# EAGLE design sensors (EAGLE 7.7.0)
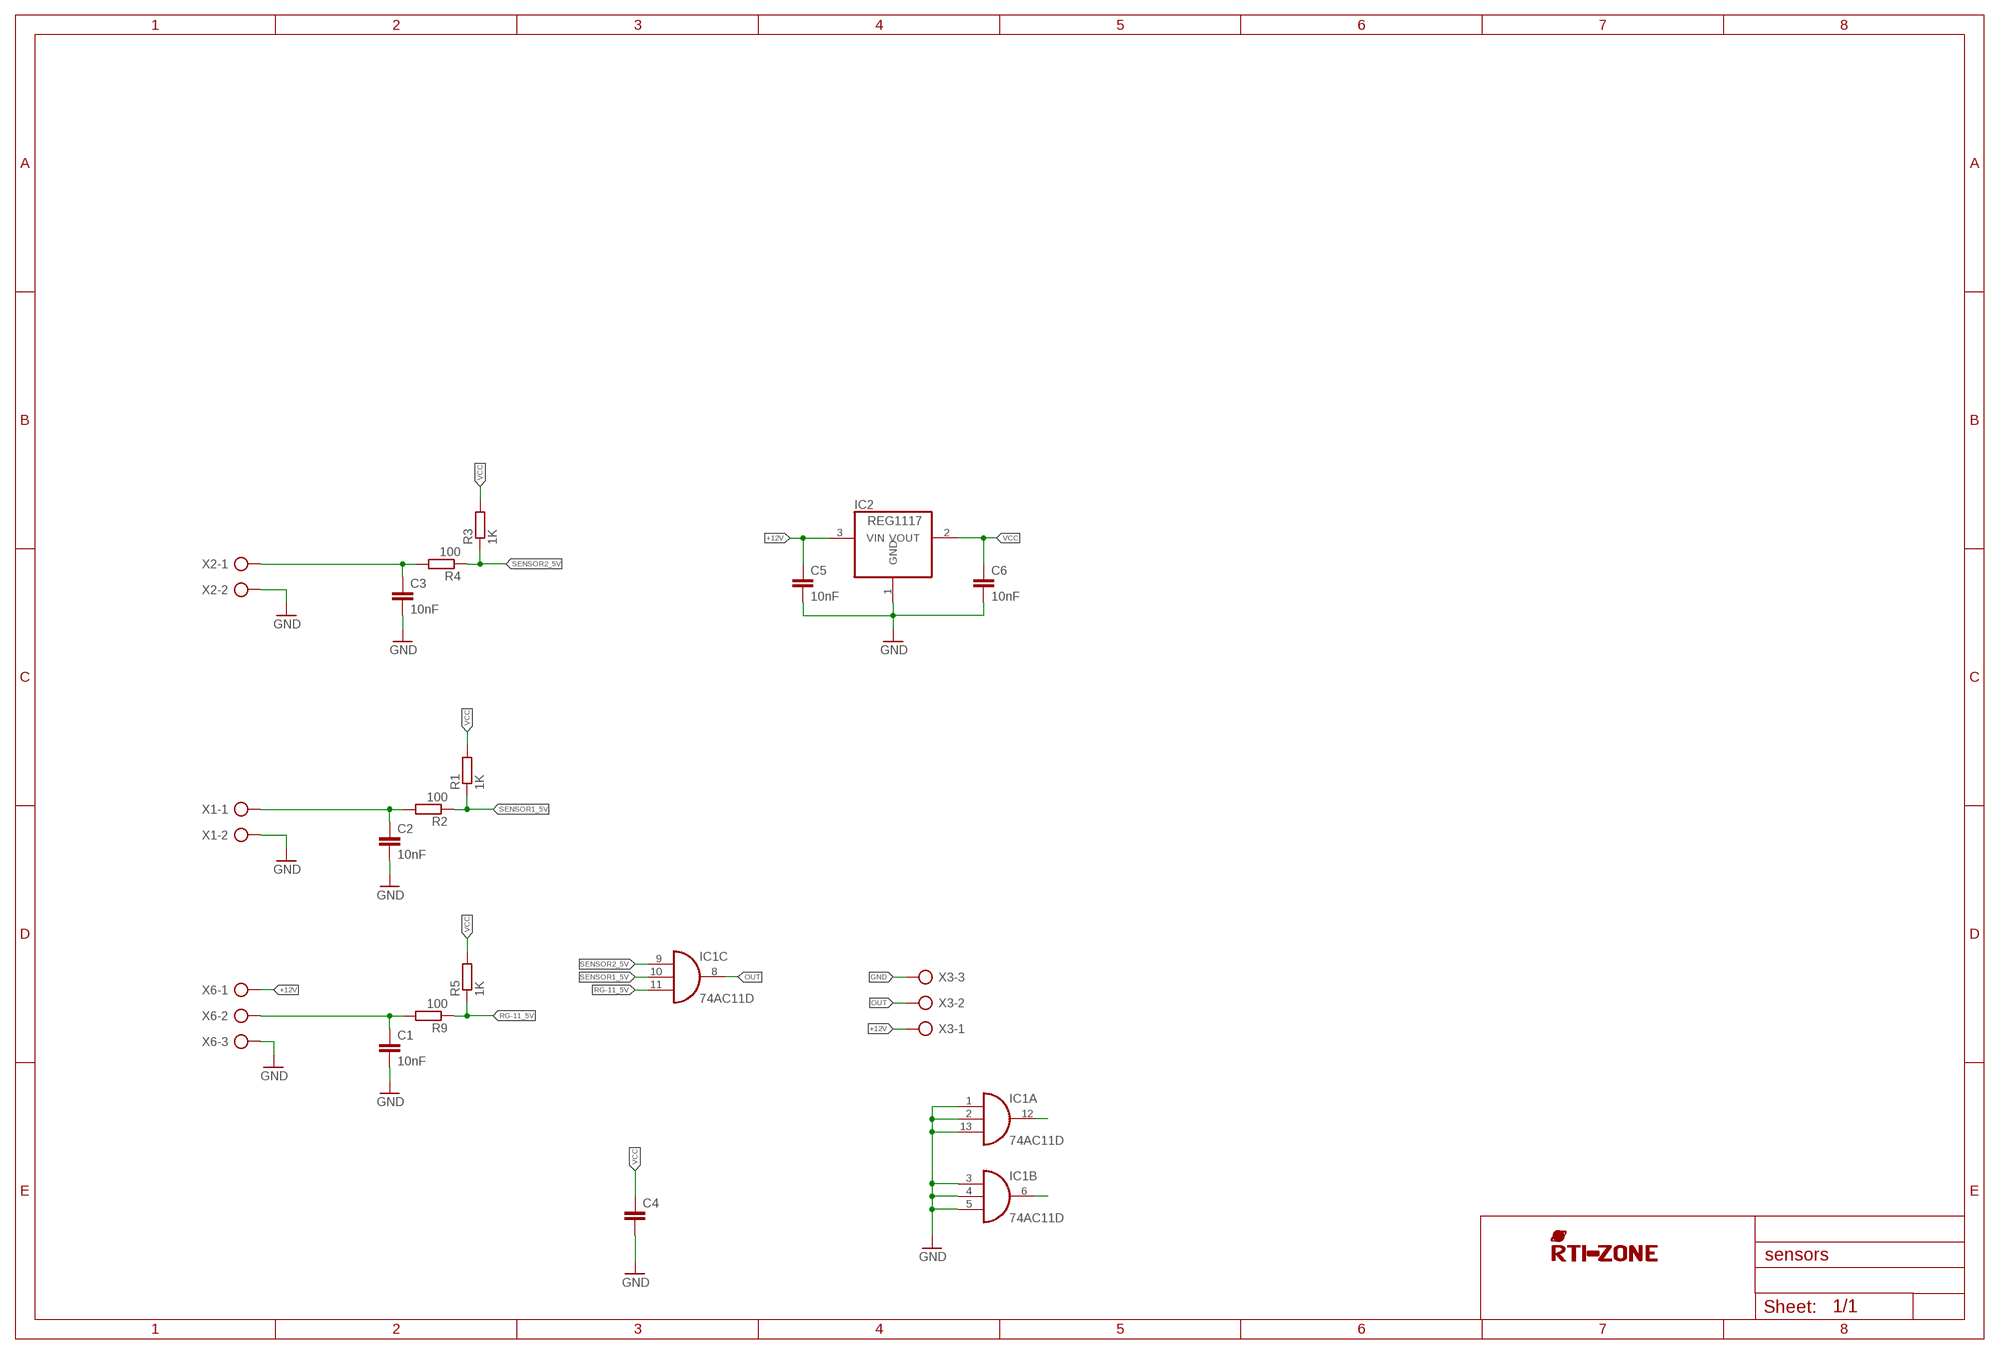
[diagram p0: schematic, sheet 1]

## Parts
C1  10nF  C-EU'0805'  [C0805]
C2  10nF  C-EU'0805'  [C0805]
C3  10nF  C-EU'0805'  [C0805]
C4  C-EU'1206'  [C1206]
C5  10nF  C-EU'0805'  [C0805]
C6  10nF  C-EU'0805'  [C0805]
IC1  74AC11D  [SO14]
IC2  REG1117  [SOT223]
R1  1K  R-EU'0805'  [R0805]
R2  100  R-EU'0805'  [R0805]
R3  1K  R-EU'0805'  [R0805]
R4  100  R-EU'0805'  [R0805]
R5  1K  R-EU'0805'  [R0805]
R9  100  R-EU'0805'  [R0805]
U$1  RTI-LOGO_BIG  [LOGO_BIG]
X1  AK500/2  [AK500/2]
X2  AK500/2  [AK500/2]
X3  AK500/3  [AK500/3]
X6  AK500/3  [AK500/3]

## Nets
+12V [+12V]: C5.1 IC2.3(VIN) X3.1 X6.1
GND: C1.2 C2.2 C3.2 C4.2 C5.2 C6.2 IC1.1(A:I0) IC1.2(A:I1) IC1.3(B:I0) IC1.4(B:I1) IC1.5(B:I2) IC1.13(A:I2) IC2.1(GND) X1.2 X2.2 X3.3 X6.3
N$1: IC1.12(A:O)
N$2: IC1.6(B:O)
OUT: IC1.8(C:O) X3.2
RG-11: C1.1 R9.2 X6.2
RG-11_5V: IC1.11(C:I2) R5.1 R9.1
SENSOR1: C2.1 R2.2 X1.1
SENSOR1_5V: IC1.10(C:I1) R1.1 R2.1
SENSOR2: C3.1 R4.2 X2.1
SENSOR2_5V: IC1.9(C:I0) R3.1 R4.1
VCC: C4.1 C6.1 IC2.2(VOUT) R1.2 R3.2 R5.2

## Power pins joined to a net without a drawn wire
GND: IC1.7(P:GND)
VCC: IC1.14(P:VCC)

## Library data of the parts
C1-C6 = rti:C-EU
IC1 = 74xx-eu:74*11: Triple 3-input AND gate
IC2 = burr-brown:REG1117: 800mA and 1A Low Dropout (LDO) Positive Regulator 1.8V, 2.5V, 2.85V, 3.3V, 5V, and Adj; MPN: REG1117; OC_FARNELL: 1097566; OC_NEWARK: 14P6981
R1-R5 R9 = rti:R-EU
U$1 = rti:RTI-LOGO
X1 X2 = nexdome:AK500/2: CONNECTOR; MF: Altech; MPN: Altech 30.702
X3 X6 = nexdome:AK500/3: CONNECTOR; MF: Altech; MPN: Altech 30.703

## Net classes
0 default: width 0.254 mm, drill 0.3 mm, clearance 0.203 mm
1 +12V: width 0.406 mm, drill 0.3 mm, clearance 0.203 mm

## Board
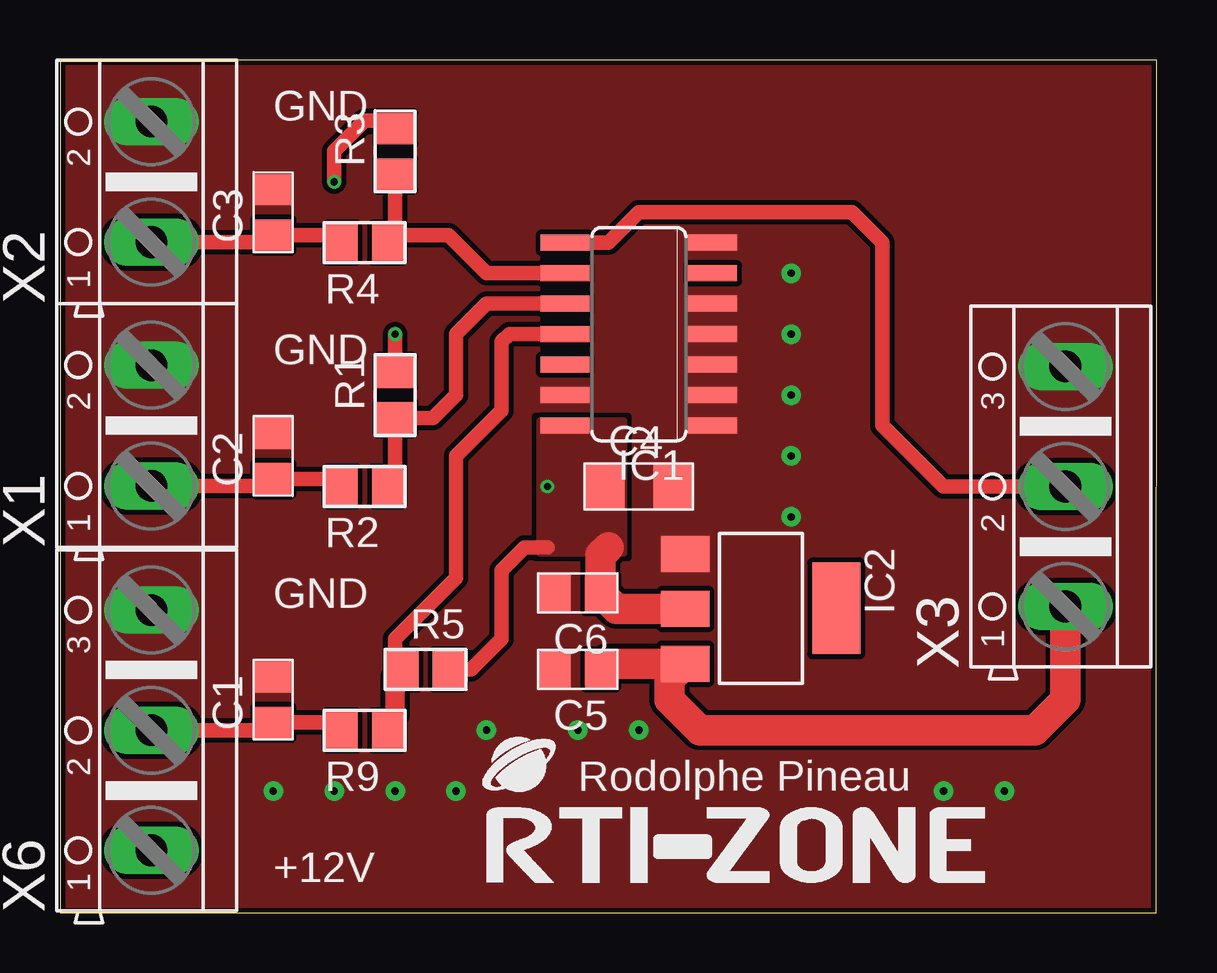
[diagram p1: board, top side]
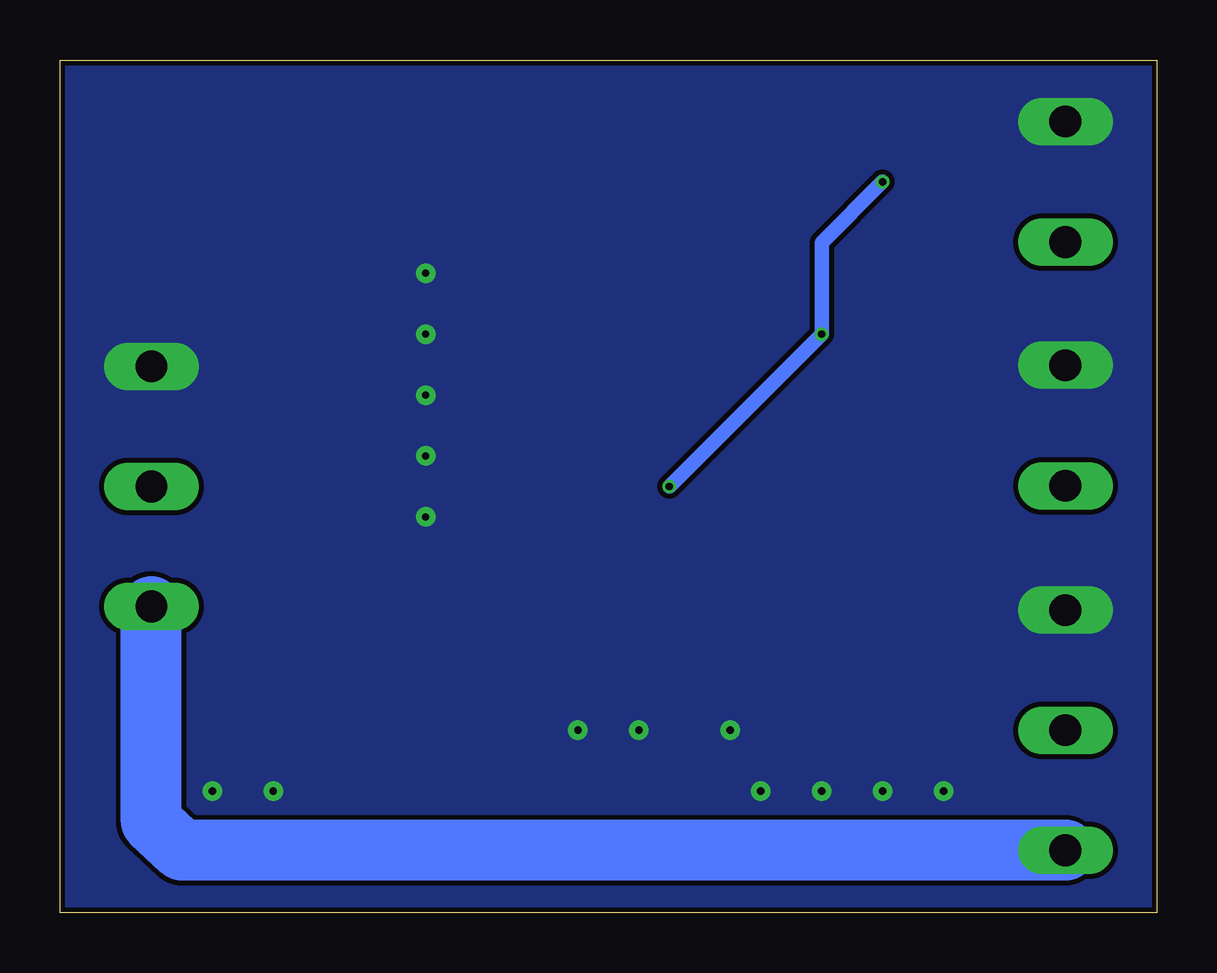
[diagram p2: board, bottom side, seen from below]

Size 45.72 x 35.56 mm. Coordinates in mm from the lower left corner, seen from the top.
Outline: 0,0 45.7,0 45.72,35.56 0,35.56 0,0
Copper layers (1*16): Top 0.035mm / dielectric 1.6mm / Bottom 0.035mm
Design rules "jlcpcb2layer": minimum track width 5mil, minimum drill 0.2mm, track to track 5mil, track to pad 5mil, pad to pad 5mil, via to via 5mil, smd to smd 5mil, copper to edge 8mil, drill to drill 0.5mm, minimum pad ring 0.13mm, minimum via ring 0.13mm, stop-mask expansion 0.05mm, vias tented up to drill 40mil, thermal gap 10mil

### Footprints (pad centres in the part's own frame; a part is rotated, then mirrored left to right if it is on the bottom)
C0805 = smd 1.3 x 1.5: 1 -0.95,0; 2 0.95,0
C1206 = smd 1.6 x 1.8: 1 -1.4,0; 2 1.4,0
SO14 = smd 0.66 x 2.032: 1 -3.81,-3.073; 2 -2.54,-3.073; 3 -1.27,-3.073; 4 0,-3.073; 5 1.27,-3.073; 6 2.54,-3.073; 7 3.81,-3.073; 8 3.81,3.073; 9 2.54,3.073; 10 1.27,3.073; 11 0,3.073; 12 -1.27,3.073; 13 -2.54,3.073; 14 -3.81,3.073
SOT223 = smd 1.499 x 2.007: 1 -2.261,-3.15; 2 0.025,-3.15; 3 2.311,-3.15 | smd 3.81 x 2.007: 4 0,3.15
R0805 = smd 1.3 x 1.5: 1 -0.95,0; 2 0.95,0
AK500/2 = drill 1.321 long: 1 -2.515,0; 2 2.515,0
AK500/3 = drill 1.321 long: 1 -5.004,0; 2 0,0; 3 5.004,0

### Placement (x,y rotation side)
C1  8.89,8.89 90 top
C2  8.89,19.05 90 top
C3  8.89,29.21 90 top
C4  24.13,17.78 0 top
C5  21.59,10.16 180 top
C6  21.59,13.34 180 top
IC1  24.13,24.13 90 top
IC2  29.21,12.7 270 top
R1  13.97,21.59 90 top
R2  12.7,17.78 180 top
R3  13.97,31.75 90 top
R4  12.7,27.94 180 top
R5  15.24,10.16 0 top
R9  12.7,7.62 180 top
U$1  17.78,1.27 0 top
X1  3.81,20.32 90 top
X2  3.81,30.48 90 top
X3  41.91,17.78 90 top
X6  3.81,7.62 90 top

### Tracks (layer width: path | path; a pad name or v marks a point on that pad's centre or on a via)
+12V
  Top 1.27: X3.1 41.91,8.89 40.64,7.62 26.67,7.62 25.4,8.89 25.4,9.73 IC2.3 22.77,10.39 C5.1
  Bottom 2.54: X6.1 40.64,2.62 41.91,3.81 X3.1
GND  (via drill 0.3 pad 0.81)
  other vias: 30.48,26.67 30.48,24.13 30.48,21.59 30.48,19.05 30.48,16.51 8.89,5.08 11.43,5.08 13.97,5.08 16.51,5.08 17.78,7.62 21.59,7.62 24.13,7.62 36.83,5.08 39.37,5.08
  pour Bottom (no thermals): 0,0 0,35.56 45.72,35.56 45.72,0
  pour Top (rank 2, no thermals): 0,0 0,35.56 45.72,35.56 45.72,0
OUT
  Top 0.61: IC1.8 22.86,27.94 24.13,29.21 33.02,29.21 34.29,27.94 34.29,20.32 36.83,17.78 X3.2
RG-11
  Top 0.61: X6.2 8.57,7.62 C1.1 11.43,7.94 R9.2
RG-11_5V
  Top 0.61: R9.1 13.97,7.94 13.97,8.26 | IC1.11 19.37,24.13 18.73,24.13 18.41,23.81 18.41,20.95 16.51,19.05 16.51,16.19 16.51,13.97 13.97,11.43 13.97,10.48 R5.1
  Top 0.813: 13.97,8.26 13.97,9.84 R5.1
SENSOR1
  Top 0.61: R2.2 11.43,18.1 C2.1 8.6,17.8 X1.1
SENSOR1_5V
  Top 0.61: R2.1 13.97,18.1 R1.1 15.56,20.64 16.51,21.59 16.51,24.13 17.78,25.4 IC1.10
SENSOR2
  Top 0.61: X2.1 8.6,27.96 C3.1 11.43,28.26 R4.2
SENSOR2_5V
  Top 0.61: R3.1 13.97,28.26 | 13.97,28.26 R4.1 | 13.97,28.26 16.19,28.26 17.78,26.67 IC1.9
VCC  (via drill 0.3)
  Top 0.61: 22.86,17.65 C4.1 | R1.2 v13.97,24.13 | v11.43,30.48 11.43,31.75 12.7,33.02 13.65,33.02 R3.2 | R5.2 17.14,10.16 18.41,11.43 18.41,14.29 19.37,15.24 20.32,15.24
  Top 1.27: IC2.2 23.2,12.68 C6.1 22.54,14.92 22.86,15.24
  Bottom 0.61: v11.43,30.48 13.97,27.94 v13.97,24.13 v20.32,17.78
  pour Top (no thermals): 20,20.5 23.5,20.5 23.5,15 20,15

### Text on the board
tPlace: GND | GND | GND | +12V